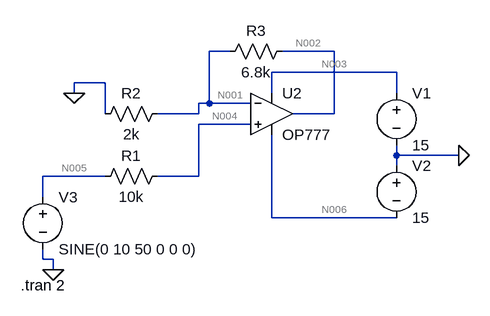
[diagram p0: schematic Draft1.asc]
Draft1.asc, the LTspice schematic file:
Version 4
SHEET 1 880 680
WIRE 128 32 96 32
WIRE 288 32 208 32
WIRE 384 64 192 64
WIRE -64 80 -112 80
WIRE -112 96 -112 80
WIRE 192 96 192 64
WIRE 384 96 384 64
WIRE 96 112 96 32
WIRE 96 112 80 112
WIRE 160 112 96 112
WIRE -64 128 -64 80
WIRE 80 128 80 112
WIRE 80 128 16 128
WIRE 288 128 288 32
WIRE 288 128 224 128
WIRE 160 144 80 144
WIRE 384 192 384 176
WIRE 480 192 384 192
WIRE 384 208 384 192
WIRE -64 224 -160 224
WIRE 80 224 80 144
WIRE 80 224 16 224
WIRE -160 256 -160 224
WIRE 192 288 192 160
WIRE 384 288 192 288
WIRE -160 352 -160 336
WIRE -144 352 -160 352
WIRE -144 368 -144 352
FLAG 480 192 0
FLAG -112 96 0
FLAG -144 368 0
SYMBOL voltage 384 80 R0
WINDOW 123 0 0 Left 0
WINDOW 39 0 0 Left 0
SYMATTR InstName V1
SYMATTR Value 15
SYMBOL voltage 384 192 R0
WINDOW 123 0 0 Left 0
WINDOW 39 0 0 Left 0
SYMATTR InstName V2
SYMATTR Value 15
SYMBOL res 32 112 R90
WINDOW 0 0 56 VBottom 2
WINDOW 3 32 56 VTop 2
SYMATTR InstName R2
SYMATTR Value 2k
SYMBOL res 32 208 R90
WINDOW 0 0 56 VBottom 2
WINDOW 3 32 56 VTop 2
SYMATTR InstName R1
SYMATTR Value 10k
SYMBOL res 224 16 R90
WINDOW 0 0 56 VBottom 2
WINDOW 3 32 56 VTop 2
SYMATTR InstName R3
SYMATTR Value 6.8k
SYMBOL voltage -160 240 R0
WINDOW 123 0 0 Left 0
WINDOW 39 0 0 Left 0
SYMATTR InstName V3
SYMATTR Value SINE(0 10 50 0 0 0)
SYMBOL OpAmps\\OP777 192 64 R0
SYMATTR InstName U2
TEXT -194 392 Left 2 !.tran 2

The netlist it stands for:
* Draft1.asc
V1 N003 0 15
V2 0 N006 15
R2 N001 0 2k
R1 N004 N005 10k
R3 N002 N001 6.8k
V3 N005 0 SINE(0 10 50 0 0 0)
XU2 N004 N001 N003 N006 N002 OP777  ; pins In+ In- V+ V- OUT
.tran 2
.lib ADI.lib
.backanno
.end

* Results of the author's LTspice run, read from the files saved beside the schematic
* Operating Point, zero values left out:
*   V(n003) = 15 V
*   V(n006) = -15 V
*   V(n001) = 188.6 µV
*   V(n004) = 108.6 µV
*   V(n002) = 769.5 µV
*   I(R3) = 85.42 nA
*   I(R1) = 10.86 nA
*   I(R2) = 94.28 nA
*   I(V3) = 10.86 nA
*   I(V2) = -304.3 µA
*   I(V1) = -304.4 µA
*   Ix(u2:1) = -10.86 nA
*   Ix(u2:2) = -8.856 nA
*   Ix(u2:99) = 304.4 µA
*   Ix(u2:50) = -304.3 µA
*   Ix(u2:45) = -85.42 nA
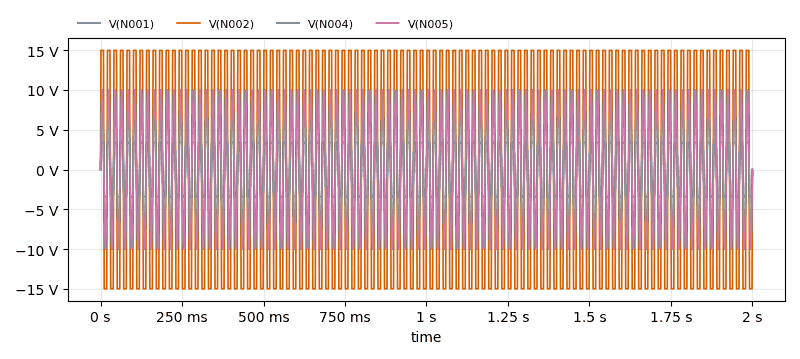
[diagram p1: Transient Analysis of Draft1.asc, plotted from the saved traces]
* Transient Analysis, 1 run:
*   V(N001): min -3.405 V, max 3.402 V, average -967.2 µV, rms 3.148 V, last -3.074 mV
*   V(N002): min -14.98 V, max 14.97 V, average -4.315 mV, rms 13.85 V, last -13.59 mV
*   V(N004): min -9.976 V, max 9.976 V, average 1.308 mV, rms 7.03 V, last 102.4 µV
*   V(N005): min -10 V, max 10 V, average 429.5 µV, rms 7.065 V, last 0 V